# Altium project sensors_panel.PrjPcb
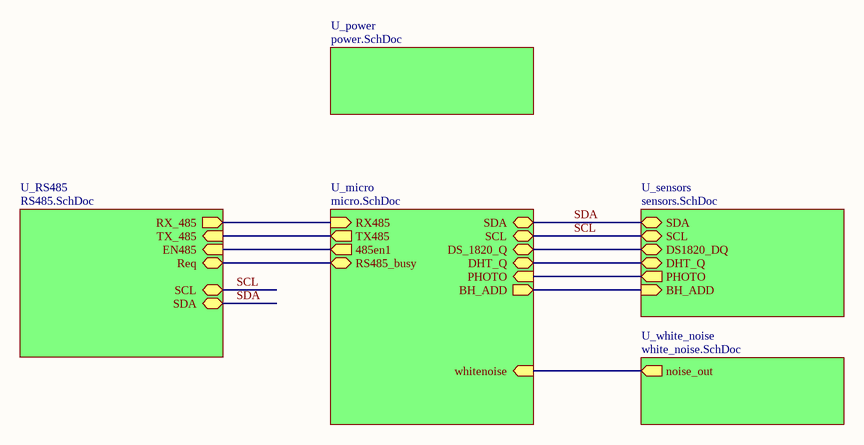
[diagram p0: top.SchDoc]
6 sheets, 92 parts. Net scope: hierarchical (ports join the sheet entries above them; power ports are global).
Board file: sensor_panel.PcbDoc
Sheets:
  top.SchDoc
    U_micro = micro.SchDoc
    U_power = power.SchDoc
    U_RS485 = RS485.SchDoc
    U_sensors = sensors.SchDoc
    U_white_noise = white_noise.SchDoc

## Sheet top.SchDoc
size A4

### Sub-sheets
U_micro = micro.SchDoc: whitenoise (in), SCL (bidir), SDA (bidir), RX485 (in), TX485 (out), 485en1 (out), RS485_busy (bidir), PHOTO (in), DS_1820_Q (bidir), DHT_Q (bidir), BH_ADD (out)
U_power = power.SchDoc: no entries
U_RS485 = RS485.SchDoc: RX_485 (out), EN485 (in), TX_485 (in), Req (bidir), SDA (bidir), SCL (bidir)
U_sensors = sensors.SchDoc: SDA (bidir), SCL (bidir), DS1820_DQ (bidir), DHT_Q (bidir), PHOTO (out), BH_ADD (in)
U_white_noise = white_noise.SchDoc: noise_out (out)

### Nets
485en: sheet U_micro/485en1, sheet U_RS485/EN485
BH_ADD: sheet U_micro/BH_ADD, sheet U_sensors/BH_ADD
photo: sheet U_micro/PHOTO, sheet U_sensors/PHOTO
RS48_busy: sheet U_micro/RS485_busy, sheet U_RS485/Req
RX485: sheet U_micro/RX485, sheet U_RS485/RX_485
SCL: sheet U_micro/SCL, sheet U_RS485/SCL, sheet U_sensors/SCL
SDA: sheet U_micro/SDA, sheet U_RS485/SDA, sheet U_sensors/SDA
TX485: sheet U_micro/TX485, sheet U_RS485/TX_485
whitenoise: sheet U_micro/whitenoise, sheet U_white_noise/noise_out
NetDHT1_2: sheet U_micro/DHT_Q, sheet U_sensors/DHT_Q
NetR31_1: sheet U_micro/DS_1820_Q, sheet U_sensors/DS1820_DQ

## Sheet micro.SchDoc
size A3
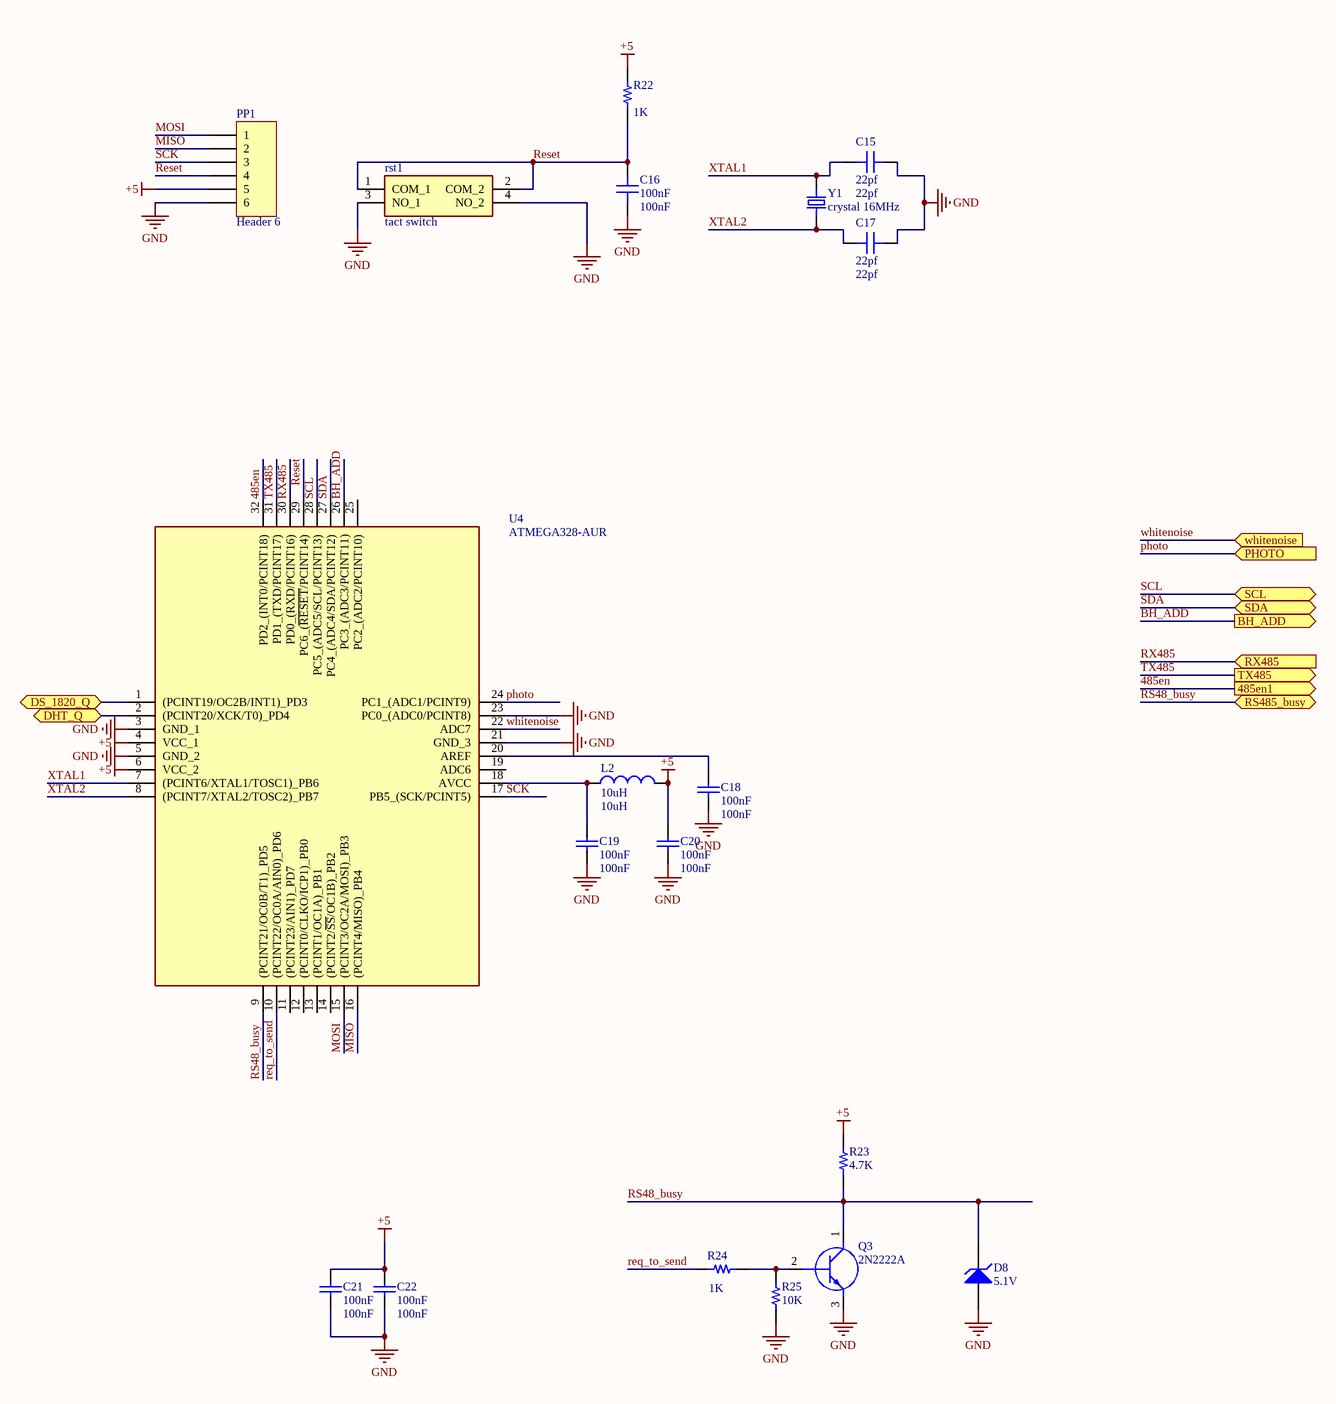
[diagram p1: micro.SchDoc]

### Parts
C15  22pf  [0603C]
C16  100nF  [0603C]
C17  22pf  [0603C]
C18  100nF  [0603C]
C19  100nF  [0603C]
C20  100nF  [0603C]
C21  100nF  [0603C]
C22  100nF  [0603C]
D8  5.1V  [Diode 1n4148 SMD]
L2  10uH  [IND1206]
PP1  Header 6  [HDR1X6]
Q3  2N2222A  [soT95p280x130-3n]
R22  1K  [0603R]
R23  4.7K  [0603R]
R24  1K  [0603R]
R25  10K  [0603R]
rst1  tact switch  [DTSM63NVB]
U4  ATMEGA328-AUR  [TQFP32_N]
Y1  crystal 16MHz  [XTAL_ECS-180-S-5P-DN-TR]

### Ports
485en1 (out), BH_ADD (out), DHT_Q (bidir), DS_1820_Q (bidir), PHOTO (in), RS485_busy (bidir), RX485 (in), SCL (bidir), SDA (bidir), TX485 (out), whitenoise (in)

### Nets
+5: C20.1 C21.1 C22.1 L2.2 PP1.5 R22.2 R23.1 U4.4(VCC_1) U4.6(VCC_2)
GND: C15.1 C16.2 C17.1 C18.2 C19.2 C20.2 C21.2 C22.2 D8.1(A) PP1.6 Q3.3(E) R25.2 rst1.3(NO_1) rst1.4(NO_2) U4.3(GND_1) U4.5(GND_2) U4.21(GND_3) U4.23(PC0_(ADC0/PCINT8))
485en: U4.32(PD2_(INT0/PCINT18)) ; port 485en1
BH_ADD: U4.26(PC3_(ADC3/PCINT11)) ; port BH_ADD
MISO: PP1.2 U4.16((PCINT4/MISO)_PB4)
MOSI: PP1.1 U4.15((PCINT3/OC2A/MOSI)_PB3)
photo: U4.24(PC1_(ADC1/PCINT9)) ; port PHOTO
req_to_send: R24.2 U4.10((PCINT22/OC0A/AIN0)_PD6)
Reset: C16.1 PP1.4 R22.1 rst1.1(COM_1) rst1.2(COM_2) U4.29(PC6_(~{RESET}/PCINT14))
RS48_busy: D8.2(K) Q3.1(C) R23.2 U4.9((PCINT21/OC0B/T1)_PD5) ; port RS485_busy
RX485: U4.30(PD0_(RXD/PCINT16)) ; port RX485
SCK: PP1.3 U4.17(PB5_(SCK/PCINT5))
SCL: U4.28(PC5_(ADC5/SCL/PCINT13)) ; port SCL
SDA: U4.27(PC4_(ADC4/SDA/PCINT12)) ; port SDA
TX485: U4.31(PD1_(TXD/PCINT17)) ; port TX485
whitenoise: U4.22(ADC7) ; port whitenoise
XTAL1: C15.2 U4.7((PCINT6/XTAL1/TOSC1)_PB6) Y1.2
XTAL2: C17.2 U4.8((PCINT7/XTAL2/TOSC2)_PB7) Y1.1
NetC18_1: C18.1 U4.20(AREF)
NetC19_1: C19.1 L2.1 U4.18(AVCC)
NetDHT1_2: U4.2((PCINT20/XCK/T0)_PD4) ; port DHT_Q
NetQ3_2: Q3.2(B) R24.1 R25.1
NetR31_1: U4.1((PCINT19/OC2B/INT1)_PD3) ; port DS_1820_Q

Not connected (* = marked no-connect by the designer): U4 11((PCINT23/AIN1)_PD7) 12((PCINT0/CLKO/ICP1)_PB0) 13((PCINT1/OC1A)_PB1) 14((PCINT2/~{SS}/OC1B)_PB2) 19(ADC6) 25(PC2_(ADC2/PCINT10))

### Library data of the parts
C15-C17 = Capacitor: CAP SMD 0603; Part Number: C0805X106K9RAC7800
  C15 C17: Value: 22pf
  C16: Value: 100nF
C18-C22 = Cap: CAP SMD 0603; Published: 8-Jun-2000; LatestRevisionDate: 17-Jul-2002; LatestRevisionNote: Re-released for DXP Platform.; PackageReference: RAD-0.3; Publisher: Altium Limited; PackageDescription: Radial Cap, Thru-Hole; 2 Leads; 0.3 in Pin Spacing; Value: 100nF
D8 = D Zener: Zener Diode 5.1v; Published: 8-Jun-2000; LatestRevisionDate: 17-Jul-2002; LatestRevisionNote: Re-released for DXP Platform.; PackageReference: DIODE-0.7; Publisher: Altium Limited; PackageDescription: Diode, Thru-Hole; 2 Leads; 0.7 in Pin Spacing
L2 = Inductor: Inductor 1206; Code_IEC: 1005; Published: 8-Jun-2000; LatestRevisionDate: 29-May-2009; LatestRevisionNote: IPC-7351 Footprint Added.; PackageReference: 0402-A; Publisher: Altium Limited; PackageDescription: Chip Inductor; Code_JEITA: 0402; Value: 10uH
PP1 = Header 6: Header, 6-Pin , female; LatestRevisionDate: 17-Jul-2002; LatestRevisionNote: Re-released for DXP Platform.; Publisher: Altium Limited
Q3 = 2N2222A: Transistor BJT NPN SMD; pin to pad: 1>3 2>1 3>2; Manufacturer_Name: Foshan Blue Rocket Elec; Datasheet Link: https://datasheet.lcsc.com/szlcsc/1901291437_Foshan-Blue-Rocket-Elec-2N2222A_C358533.pdf; Height: 4.7mm; Manufacturer_Part_Number: 2N2222A
R22-R25 = Resistor: RES SMD 0603; Part Number: RCS0805100KFKEA
  R22 R24: Value: 1K
  R23: Value: 4.7K
  R25: Value: 10K
rst1 = DTSM-66R-V-T_R: Push Button SMD - 4PIN; Manufacturer_Name: Diptronics; Manufacturer_Part_Number: DTSM-66R-V-T/R; Datasheet Link: https://www.mouser.co.uk/datasheet/2/910/464_DTSMJ-6-1571536.pdf; Height: 7.1mm; Mouser Part Number: 113-DTSM66RVTR; Mouser Price/Stock: https://www.mouser.co.uk/ProductDetail/Diptronics/DTSM-66R-V-T-R?qs=MLItCLRbWsxl2%252BVY862AIw%3D%3D
U4 = ATMEGA328-AUR: ATMEGA328p-SMD-LQFP32; Manufacturer_Name: Microchip; Datasheet Link: https://componentsearchengine.com/Datasheets/1/ATMEGA328-AUR.pdf; Height: 1.2mm; Manufacturer_Part_Number: ATMEGA328-AUR; Mouser Part Number: 556-ATMEGA328-AUR; Mouser Price/Stock: https://www.mouser.co.uk/ProductDetail/Microchip-Technology-Atmel/ATMEGA328-AUR?qs=lwdSMh1%2FoYLfe%252B5OKFEFrw%3D%3D; Arrow Part Number: ATMEGA328-AUR; Arrow Price/Stock: https://www.arrow.com/en/products/atmega328-aur/microchip-technology
Y1 = ECS-180-S-5P-DN-TR: Crystals 16MHz; MF: ECS International; MP: ECS-180-S-5P-DN-TR; Value: 16MHz; SnapEDA_Link: https://www.snapeda.com/parts/ECS-180-S-5P-DN-TR/ECS%20International/view-part/2547669/?ref=snap; Price: None; Package: HC49/US ECS International; Availability: Unavailable

## Sheet power.SchDoc
size A4
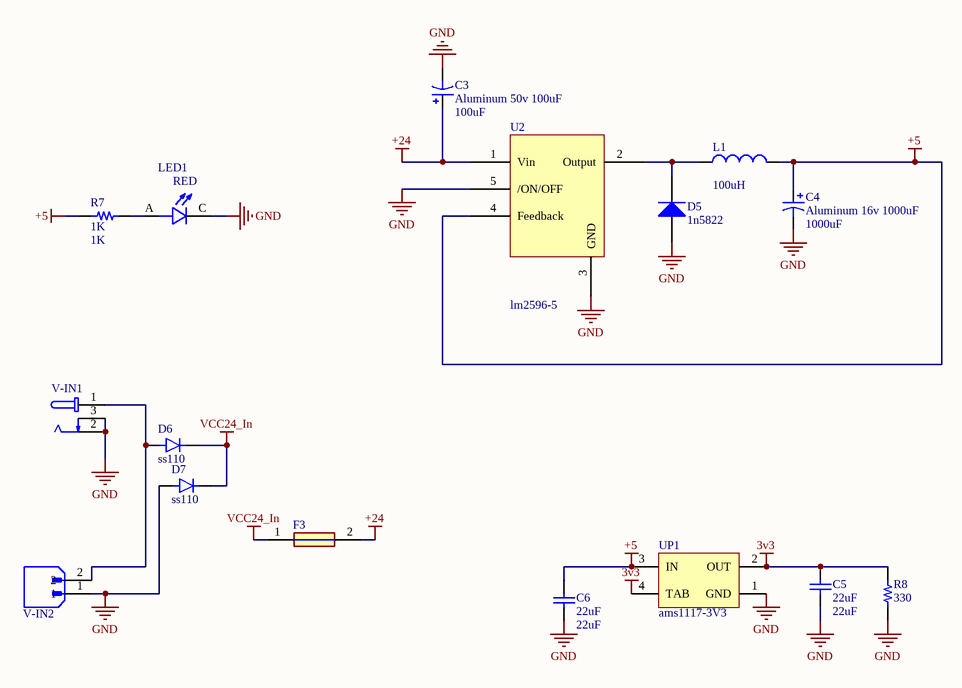
[diagram p2: power.SchDoc]

### Parts
C3  Aluminum 50v 100uF  value 100uF  [Cap SMD 100UF 35~50v]
C4  Aluminum 16v 1000uF  value 1000uF  [CAP SMD 1000UF 16V]
C5  22uF  [0603C]
C6  22uF  [0603C]
D5  1n5822  [SMA DIODE 2]
D6  ss110  [ss110]
D7  ss110  [ss110]
F3  fuse 2amp  [1206 FUSE]  (value not drawn)
L1  value 100uH  [inductor]  (hidden comment: inductor 100uH)
LED1  LED RED  [LED_7012X1]  (value not drawn)
R7  1K  [0603R]
R8  330  [0603R]
U2  lm2596-5  [2596]
UP1  ams1117-3V3  [SOT223]
V-IN1  DC jack power  [GCT_DCJ235-05-A-XX-X_REVA]  (value not drawn)
V-IN2  Phoenix  [AMPHENOL_OQ0271510000G]  (value not drawn)

### Nets
3v3: C5.2 R8.1 UP1.2(OUT) UP1.4(TAB)
+5: C4.1 C6.2 L1.2 R7.1 U2.4(Feedback) UP1.3(IN)
+24: C3.1 F3.2 U2.1(Vin)
GND: C3.2 C4.2 C5.1 C6.1 D5.1(A) D7.A LED1.C R8.2 U2.3(GND) U2.5(/ON/OFF) UP1.1(GND) V-IN1.2 V-IN1.3 V-IN2.1
VCC24_In: D6.C(K) D7.C(K) F3.1
NetD5_2: D5.2(K) L1.1 U2.2(Output)
NetD6_A: D6.A V-IN1.1 V-IN2.2
NetLED1_A: LED1.A R7.2

### Notes on the sheet
- (in symbol 7012X1) RED

### Library data of the parts
C3 C4 = Cap Pol1: CAP POLAR SMD; Published: 8-Jun-2000; LatestRevisionDate: 17-Jul-2002; LatestRevisionNote: Re-released for DXP Platform.; PackageReference: RB7.6-15; Publisher: Altium Limited; PackageDescription: Polarized Capacitor (Radial); 2 Leads
C5 C6 = Cap: CAP SMD 0603; Published: 8-Jun-2000; LatestRevisionDate: 17-Jul-2002; LatestRevisionNote: Re-released for DXP Platform.; PackageReference: RAD-0.3; Publisher: Altium Limited; PackageDescription: Radial Cap, Thru-Hole; 2 Leads; 0.3 in Pin Spacing; Value: 22uF
D5 = Diode 1N4007: 1 Amp schottky Diode SMA; Published: 8-Jun-2000; LatestRevisionDate: 17-Jul-2002; LatestRevisionNote: Re-released for DXP Platform.; DatasheetVersion: 1998; PackageVersion: Aug-1999; PackageReference: DO-41; Publisher: Altium Limited; PackageDescription: Diode, Axial; Body 5.2 x 2.7 mm (LxDia. max), Lead Dia. 0.86 mm (max); Code_JEDEC: DO-204-AL; ComponentLink1Description: Manufacturer Link; ComponentLink1URL: http://www.fairchildsemi.com/; ComponentLink2Description: Datasheet; ComponentLink2URL: http://www.fairchildsemi.com/ds/1N%2F1N4001.pdf
D6 D7 = SBR0560S1-7: Diode Super Barrier 60V 500mA Surface Mount SOD-123; MF: Diodes Inc.; MP: SBR0560S1-7; Availability: Unavailable; SnapEDA_Link: https://www.snapeda.com/parts/SBR0560S1-7/Diodes%20Inc./view-part/491648/?ref=snap; Package: SOD-123 Diodes Inc.; Value: *; Price: None
F3 = 1206SFS200F_63-2: Fuse 1206; Manufacturer_Name: TE Connectivity; Manufacturer_Part_Number: 1206SFS200F/63-2; Datasheet Link: http://docs-emea.rs-online.com/webdocs/13b6/0900766b813b6e27.pdf; Height: 1.17mm
L1 = Inductor: Inductor 12*12mm SMD; Code_IEC: 1005; Published: 8-Jun-2000; LatestRevisionDate: 29-May-2009; LatestRevisionNote: IPC-7351 Footprint Added.; PackageReference: 0402-A; Publisher: Altium Limited; PackageDescription: Chip Inductor; Code_JEITA: 0402
LED1 = 7012X1: LED SMD 0805 RED; Package: None; Price: None; Value: *; MP: 7012X1; Availability: Unavailable
R7 R8 = Resistor: as R22 on sheet micro
  R7: Value: 1K
  R8: Value: 330
U2 = lm2596
UP1 = AMS1117-x.x: 3.3 Volt, 800mA SOT-223; Designer: Ali Hafizi; Data: 16-12-2016
V-IN1 = DCJ235-05-A-XX-X_REVA: Dc Power Jack on-board; MF: Global Connector Technology; MP: DCJ235-05-A-K1-A; Price: None; Availability: Unavailable; Package: None; SnapEDA_Link: https://www.snapeda.com/parts/DCJ235-05-A-K1-A/Global%20Connector%20Technology/view-part/813042/?ref=snap; Value: *
V-IN2 = OQ0271510000G: Phoenix Terminal Right 2PIN; MF: Amphenol Anytek; MP: OQ0271510000G; Value: *; Check_prices: https://www.snapeda.com/parts/OQ0271510000G/Amphenol/view-part/4075971/?ref=eda; SnapEDA_Link: https://www.snapeda.com/parts/OQ0271510000G/Amphenol/view-part/4075971/?ref=snap; Price: None; Availability: Warning; Purchase-URL: https://pricing.snapeda.com/search/part/OQ0271510000G/?ref=eda; Package: None

## Sheet RS485.SchDoc
size A4
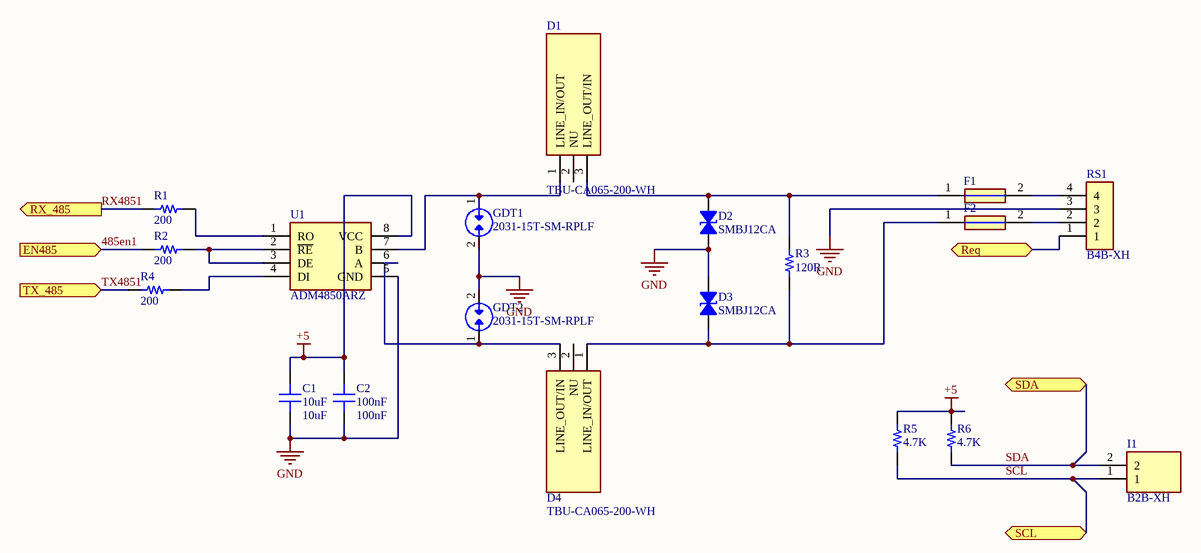
[diagram p3: RS485.SchDoc]

### Parts
C1  10uF  [cap805]
C2  100nF  [cap805]
D1  TBU-CA065-200-WH  [TBUCA025050WH]
D2  SMBJ12CA  [DO214AA SMB]
D3  SMBJ12CA  [DO214AA SMB]
D4  TBU-CA065-200-WH  [TBUCA025050WH]
F1  fuse 100mAmp  [fuse3216]  (value not drawn)
F2  fuse 100mAmp  [fuse3216]  (value not drawn)
GDT1  2031-15T-SM-RPLF  [TVS_2031-15T-SM-RPLF]
GDT2  2031-15T-SM-RPLF  [TVS_2031-15T-SM-RPLF]
I1  B2B-XH  [JST-B2B-XH]
R1  200  [0603R]
R2  200  [0603R]
R3  120R  [0603R]
R4  200  [0603R]
R5  4.7K  [0603R]
R6  4.7K  [0603R]
RS1  B4B-XH  [JST-B4B-XH]
U1  ADM4850ARZ  [SO8_N]

### Ports
EN485 (in), Req (bidir), RX_485 (out), SCL (bidir), SDA (bidir), TX_485 (in)

### Nets
+5: C1.1 C2.1 R5.1 R6.1 U1.8(VCC)
GND: C1.2 C2.2 D2.1 D3.2 GDT1.2 GDT2.2 RS1.3 U1.5(GND)
485en1: R2.2 ; port EN485  [project net 485en]
RS48_busy: RS1.1 ; port Req
RX4851: R1.2 ; port RX_485  [project net RX485]
SCL: I1.1 R5.2 ; port SCL
SDA: I1.2 R6.2 ; port SDA
TX4851: R4.2 ; port TX_485  [project net TX485]
NetD1_1: D1.1(LINE_IN/OUT) GDT1.1 U1.7(B)
NetD1_3: D1.3(LINE_OUT/IN) D2.2 F1.1 R3.1
NetD3_1: D3.1 D4.1(LINE_IN/OUT) F2.1 R3.2
NetD4_3: D4.3(LINE_OUT/IN) GDT2.1 U1.6(A)
NetF1_2: F1.2 RS1.4
NetF2_2: F2.2 RS1.2
NetR1_1: R1.1 U1.1(RO)
NetR2_1: R2.1 U1.2(~{RE}) U1.3(DE)
NetR4_1: R4.1 U1.4(DI)

Not connected (* = marked no-connect by the designer): D1 2(NU); D4 2(NU)

### Library data of the parts
C1 C2 = Capacitor: CAP SMD 0805; Part Number: C0805X106K9RAC7800
  C1: Value: 10uF
  C2: Value: 100nF
D1 D4 = TBU-CA065-200-WH: TVS Diode (Bi-directional); Manufacturer_Name: Bourns; Datasheet Link: https://www.bourns.com/data/global/pdfs/TBU-CA.pdf; Height: 1mm; Manufacturer_Part_Number: TBU-CA065-200-WH; Mouser Part Number: 652-TBU-CA065-200-WH; Mouser Price/Stock: https://www.mouser.co.uk/ProductDetail/Bourns/TBU-CA065-200-WH?qs=kLtMOTa49OkdVs42fYbv8A%3D%3D; Arrow Part Number: TBU-CA065-200-WH; Arrow Price/Stock: https://www.arrow.com/en/products/tbu-ca065-200-wh/bourns?region=nac
D2 D3 = SMBJ12CA: TVS DIODE 12V 19.9V SMB; Manufacturer: AVX Corporation; Bidirectional Channels: 1; Current - Peak Pulse (10/1000µs): 30.15A; Power Line Protection: No; Power - Peak Pulse: 600W; Type: Zener; Voltage - Breakdown (Min): 13.3V; Part Number: SMBJ12CA; Applications: General Purpose; ComponentLink1Description: Datasheet; ComponentLink1URL: //media.digikey.com/pdf/Data%20Sheets/AVX%20PDFs/Transient%20Suppression%20Diodes.pdf; ComponentLink2Description: DigiKey Link; ComponentLink2URL: http://digikey.com/product-detail/en/avx-corporation/SMBJ12CA/478-7062-1-ND/3340353; LastUpdated: 9/2/2020 1:28:17 AM; Lifecycle Status: Active; Minimum Order: 1; Mounting Type: Surface Mount; Operating Temperature: -55°C ~ 150°C (TJ); Package / Case: DO-214AA, SMB; Packaging: TapeAndReel; PartId: 9012; Part Status: Active; Price: 0.16; Series: -; Supplier 1: DigiKey; Supplier Part Number 1: 478-7062-1-ND; Supplier Device Package: SMB; Voltage - Clamping (Max) @ Ipp: 19.9V; Voltage - Reverse Standoff (Typ): 12V
F1 F2 = 1206SFS200F_63-2: as F3 on sheet power; Datasheet Link: http://docs-emea.rs-online.com/webdocs/13b6/0900766b813b6e27.pdf; Height: 1.17mm
GDT1 GDT2 = 2031-15T-SM-RPLF: Gas Discharge Tube SMD; Package: None; Price: None; Value: *; MP: 2031-15T-SM-RPLF; Availability: Unavailable
I1 = B2B-XH: XH 2pin standing
R1-R6 = CRCW080510K0JNEAIF: RES SMD 0603; Manufacturer: Vishay Dale; Power (Watts): 0.125W, 1/8W; Resistance: 10 kOhms; Temperature Coefficient: ±200ppm/°C; Tolerance: ±5%; Part Number: CRCW080510K0JNEAIF; ComponentLink1Description: Datasheet; ComponentLink1URL: http://www.vishay.com/docs/20024/dcrcwife3.pdf; ComponentLink2Description: DigiKey Link; ComponentLink2URL: http://digikey.com/product-detail/en/vishay-dale/CRCW080510K0JNEAIF/541-10KAPCT-ND/3477322; Composition: Thick Film; Device Package: 0805 (2012 Metric); Features: Automotive AEC-Q200, Pulse Withstanding; Height - Seated (Max): 0.020" (0.50mm); LastUpdated: 9/2/2020 1:14:55 AM; Lifecycle Status: Active; Minimum Order: 1; Number of Terminations: 2; Operating Temperature: -55°C ~ 155°C; Package / Case: 0805 (2012 Metric); Packaging: TapeAndReel; PartId: 40891; Part Status: Active; Price: 0.08; Ratings: AEC-Q200; Series: CRCW-IF; Size / Dimension: 0.079" L x 0.049" W (2.00mm x 1.25mm); Supplier 1: DigiKey; Supplier Part Number 1: 541-10KAPCT-ND; Supplier Device Package: 0805
  R1 R2 R4: Value: 200
  R3: Value: 120R
  R5 R6: Value: 4.7K
RS1 = B4B-XH: XH 4pin standing
U1 = ADM4850ARZ: MAX485 SMD; Manufacturer_Name: Analog Devices; Datasheet Link: http://www.analog.com/static/imported-files/data_sheets/ADM4850_4851_4852_4853_4854_4855_4856_4857.pdf; Height: 1.75mm; Manufacturer_Part_Number: ADM4850ARZ; Mouser Part Number: 584-ADM4850ARZ; Mouser Price/Stock: https://www.mouser.com/Search/Refine.aspx?Keyword=584-ADM4850ARZ; Arrow Part Number: ADM4850ARZ; Arrow Price/Stock: https://www.arrow.com/en/products/adm4850arz/analog-devices

## Sheet sensors.SchDoc
size A4
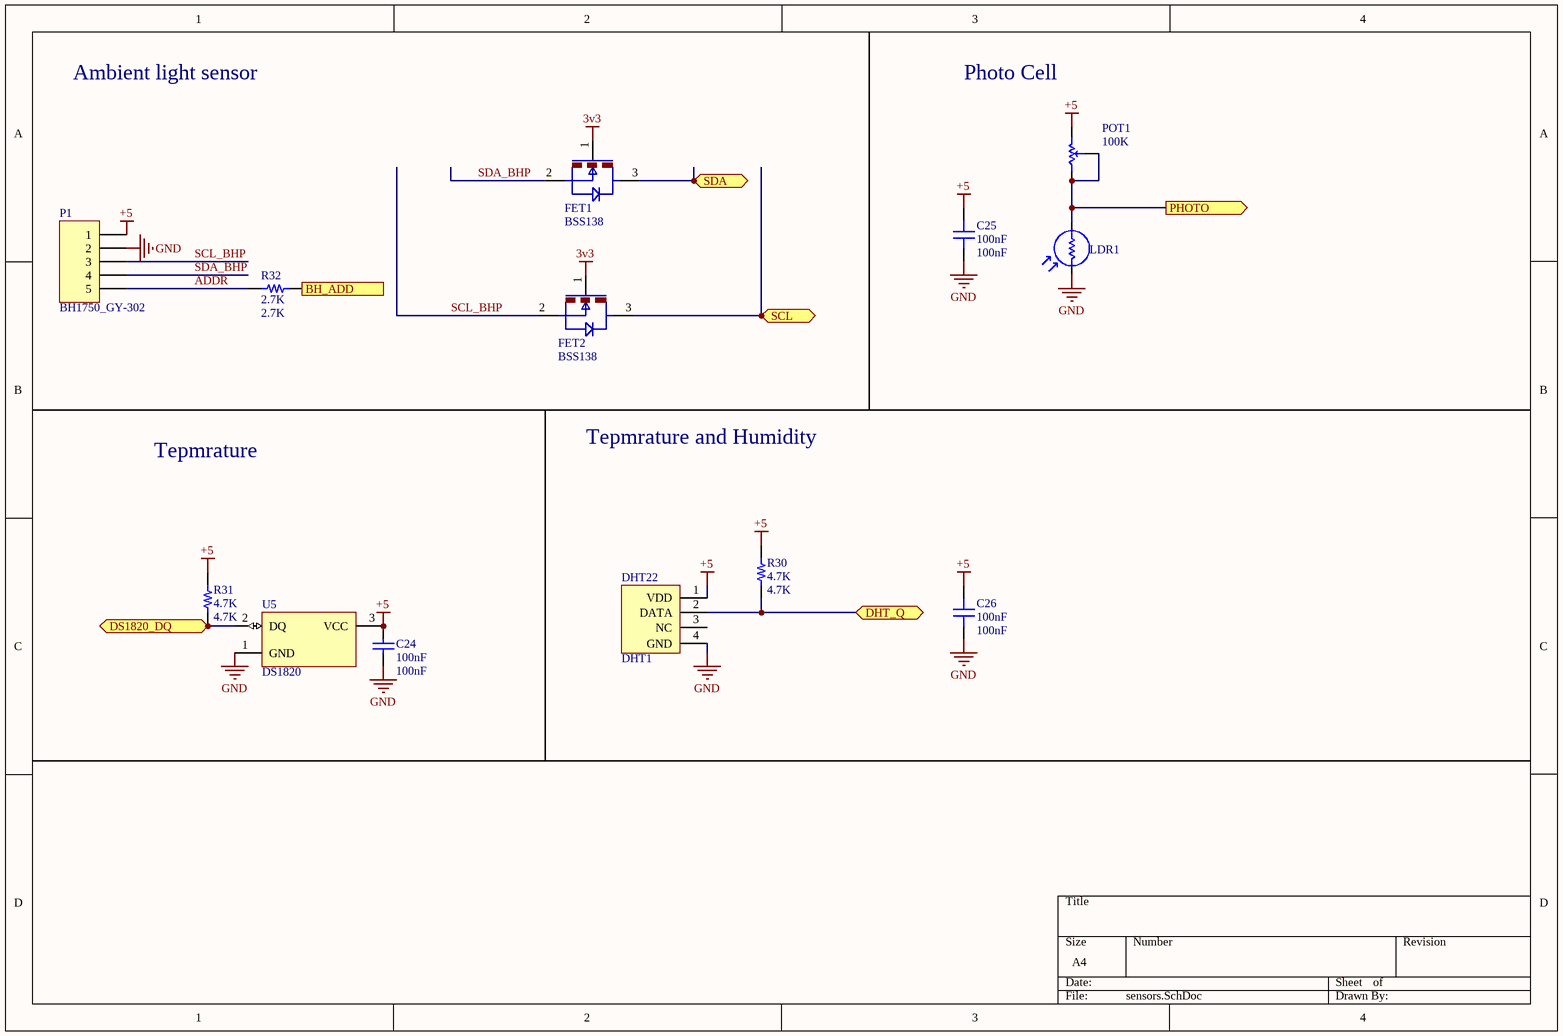
[diagram p4: sensors.SchDoc]

### Parts
C24  100nF  [0603C]
C25  100nF  [0603C]
C26  100nF  [0603C]
DHT1  DHT22  [DHT22]
FET1  BSS138  [SOT-23]
FET2  BSS138  [SOT-23]
LDR1  PhotoCell-5mm  [PhotoCell]  (value not drawn)
P1  BH1750_GY-302  [BH1750]
POT1  100K  [POT 2]
R30  4.7K  [0603R]
R31  4.7K  [0603R]
R32  2.7K  [0603R]
U5  DS1820  [DS1820]

### Ports
BH_ADD (in), DHT_Q (bidir), DS1820_DQ (bidir), PHOTO (out), SCL (bidir), SDA (bidir)

### Nets
3v3: FET1.1(G) FET2.1(G)
+5: C24.2 C25.1 C26.1 DHT1.1(VDD) P1.1 POT1.2(CW) R30.2 R31.2 U5.3(VCC)
GND: C24.1 C25.2 C26.2 DHT1.4(GND) LDR1.1 P1.2 U5.1(GND)
ADDR: P1.5 R32.2
BH_ADD: R32.1 ; port BH_ADD
photo: LDR1.2 POT1.1(CCW) POT1.3(SetPoint) ; port PHOTO
SCL: FET2.3(D) ; port SCL
SCL_BHP: FET2.2(S) P1.3
SDA: FET1.3(D) ; port SDA
SDA_BHP: FET1.2(S) P1.4
NetDHT1_2: DHT1.2(DATA) R30.1 ; port DHT_Q
NetR31_1: R31.1 U5.2(DQ) ; port DS1820_DQ

Not connected (* = marked no-connect by the designer): DHT1 3(NC)

### Notes on the sheet
- Ambient light sensor
- Photo Cell
- Tepmrature and Humidity
- Tepmrature

### Library data of the parts
C24 = Cap: CAP SMD 0603; Published: 8-Jun-2000; LatestRevisionDate: 17-Jul-2002; LatestRevisionNote: Re-released for DXP Platform.; PackageReference: RAD-0.3; Publisher: Altium Limited; PackageDescription: Radial Cap, Thru-Hole; 2 Leads; 0.3 in Pin Spacing; Value: 100nF
C25 C26 = Capacitor: as C15 on sheet micro; Value: 100nF
DHT1 = DHT22: Temprature & Humidity Sensor
FET1 FET2 = BSS138: MOSFET N-channel SMD
LDR1 = LDR: Photo Cell- Variable Resistor With Light; Company: IPA CO.; Designer: Saeid Jorablo; Last Update Time: 2008/07/17
P1 = Header 5: Ambiant light sensor; LatestRevisionDate: 17-Jul-2002; LatestRevisionNote: Re-released for DXP Platform.; Publisher: Altium Limited
POT1 = POT: Variable Resistor; Value: 100K
R30-R32 = Resistor: as R22 on sheet micro
  R30 R31: Value: 4.7K
  R32: Value: 2.7K
U5 = DS1820: 1-Wire Digital Thermometer; ComponentAvailability: Obsolete; Published: 13-Oct-2000; LatestRevisionDate: 17-Jul-2002; LatestRevisionNote: Re-released for DXP Platform.; DatasheetVersion: 5-Mar-1998; PackageVersion: 1999; PackageReference: PR35; Publisher: Altium Limited; PackageDescription: TO, Flat Index; 3 In-Line, Axial Leads; Body Dia. 4.6mm; Leads 0.56 x 0.51 mm (max); ComponentLink1Description: Manufacturer Link; ComponentLink1URL: http://www.maxim-ic.com/; ComponentLink2Description: Datasheet; ComponentLink2URL: http://pdfserv.maxim-ic.com/en/ds/DS1820-DS1820S.pdf; ComponentLink3Description: Discontinuation Notice; ComponentLink3URL: http://www.maxim-ic.com/qa/pdfs/non-obsolescence-letter.pdf

## Sheet white_noise.SchDoc
size A4
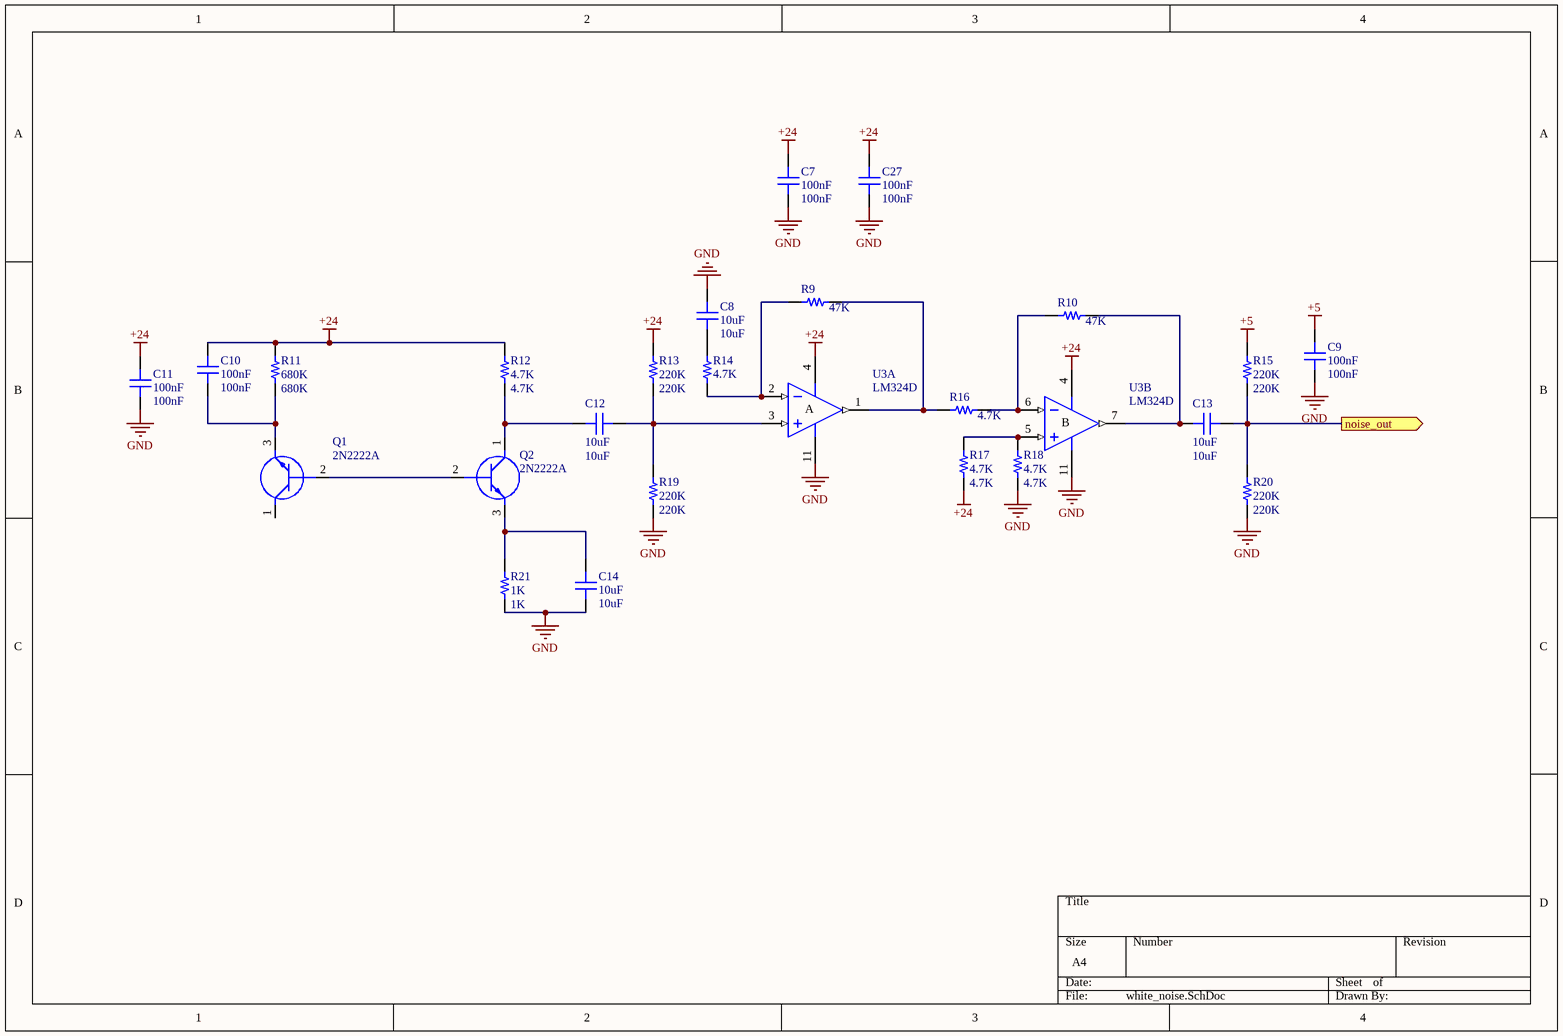
[diagram p5: white_noise.SchDoc]

### Parts
C7  100nF  [cap805]
C8  10uF  [cap805]
C9  100nF  [cap805]
C10  100nF  [cap805]
C11  100nF  [cap805]
C12  10uF  [cap805]
C13  10uF  [cap805]
C14  10uF  [cap805]
C27  100nF  [cap805]
Q1  2N2222A  [soT95p280x130-3n]
Q2  2N2222A  [soT95p280x130-3n]
R9  47K  [0603R]
R10  47K  [0603R]
R11  680K  [0603R]
R12  4.7K  [0603R]
R13  220K  [0603R]
R14  4.7K  [0603R]
R15  220K  [0603R]
R16  4.7K  [0603R]
R17  4.7K  [0603R]
R18  4.7K  [0603R]
R19  220K  [0603R]
R20  220K  [0603R]
R21  1K  [0603R]
U3  LM324D  [SO14_N]  (parts A,B of 4)

### Ports
noise_out (out)

### Nets
+5: C9.1 R15.2
+24: C7.1 C10.2 C11.1 C27.1 R11.2 R12.2 R13.2 R17.1 U3.4(V+)
GND: C7.2 C8.1 C9.2 C11.2 C14.1 C27.2 R18.1 R19.1 R20.1 R21.1 U3.11(V-)
whitenoise: C13.1 R15.1 R20.2 ; port noise_out
NetC8_2: C8.2 R14.2
NetC10_1: C10.1 Q1.3(E) R11.1
NetC12_1: C12.1 R13.1 R19.2 U3.3(IN+)
NetC12_2: C12.2 Q2.1(C) R12.1
NetC13_2: C13.2 R10.1 U3.7(OUT)
NetC14_2: C14.2 Q2.3(E) R21.2
NetQ1_2: Q1.2(B) Q2.2(B)
NetR9_1: R9.1 R16.2 U3.1(OUT)
NetR9_2: R9.2 R14.1 U3.2(IN-)
NetR10_2: R10.2 R16.1 U3.6(IN-)
NetR17_2: R17.2 R18.2 U3.5(IN+)

Not connected (* = marked no-connect by the designer): Q1 1(C)

### Notes on the sheet
- (in symbol LM324D, part A) A
- (in symbol LM324D, part B) B

### Library data of the parts
C7-C14 C27 = Capacitor: as C1 on sheet RS485
  C7 C9-C11 C27: Value: 100nF
  C8 C12-C14: Value: 10uF
Q1 Q2 = 2N2222A: Transistor BJT NPN SMD; pin to pad: 1>3 2>1 3>2; Manufacturer_Name: Foshan Blue Rocket Elec; Datasheet Link: https://datasheet.lcsc.com/szlcsc/1901291437_Foshan-Blue-Rocket-Elec-2N2222A_C358533.pdf; Height: 4.7mm; Manufacturer_Part_Number: 2N2222A
R9-R21 = Resistor: as R22 on sheet micro
  R9 R10: Value: 47K
  R11: Value: 680K
  R12 R14 R16-R18: Value: 4.7K
  R13 R15 R19 R20: Value: 220K
  R21: Value: 1K
U3 = LM324D: Low-Power Quad Operational Amplifier SMD; Published: 24-Aug-2001; LatestRevisionDate: 13-Apr-2006; LatestRevisionNote: IPC-7351 Footprint Added.; DatasheetVersion: Jun-1999; PackageVersion: Sep-1998; PackageReference: SO14; Publisher: Altium Limited; PackageDescription: 14-Pin Small Outline Integrated Circuit 1.27 mm Pitch; Code_IPC: SOIC127P600-14; ComponentLink1Description: Manufacturer Link; ComponentLink1URL: http://www.st.com/; ComponentLink2Description: Datasheet; ComponentLink2URL: http://www.st.com/stonline/products/literature/ds/2156/lm324.pdf

## Nets that join several sheets
3v3: power (C5.2 R8.1 UP1.2 UP1.4), sensors (FET1.1 FET2.1)
+5: micro (9 pins), power (6 pins), RS485 (5 pins), sensors (9 pins), white_noise (C9.1 R15.2)
+24: power (C3.1 F3.2 U2.1), white_noise (9 pins)
GND: micro (18 pins), power (14 pins), RS485 (8 pins), sensors (7 pins), white_noise (11 pins)
485en: micro (U4.32), RS485 (R2.2)
BH_ADD: micro (U4.26), sensors (R32.1)
NetDHT1_2: micro (U4.2), sensors (DHT1.2 R30.1)
NetR31_1: micro (U4.1), sensors (R31.1 U5.2)
photo: micro (U4.24), sensors (LDR1.2 POT1.1 POT1.3)
RS48_busy: micro (D8.2 Q3.1 R23.2 U4.9), RS485 (RS1.1)
RX485: micro (U4.30), RS485 (R1.2)
SCL: micro (U4.28), RS485 (I1.1 R5.2), sensors (FET2.3)
SDA: micro (U4.27), RS485 (I1.2 R6.2), sensors (FET1.3)
TX485: micro (U4.31), RS485 (R4.2)
whitenoise: micro (U4.22), white_noise (C13.1 R15.1 R20.2)